# Altium schematic sheet SchematCzujnikUV.SchDoc
size A4; SheetNumber: 1; SheetTotal: 1; SPICEModelCacheTXBQMHXL: <root> / <DocumentId>TXBQMHXL</DocumentId> / <CacheFrame Number="0"> / <Model Name="cap" Kind="MDL"> / <Text>*Default semiconductor capacitor / .MODEL CAP C()</Text> / </Model> / </CacheFrame> / </root>
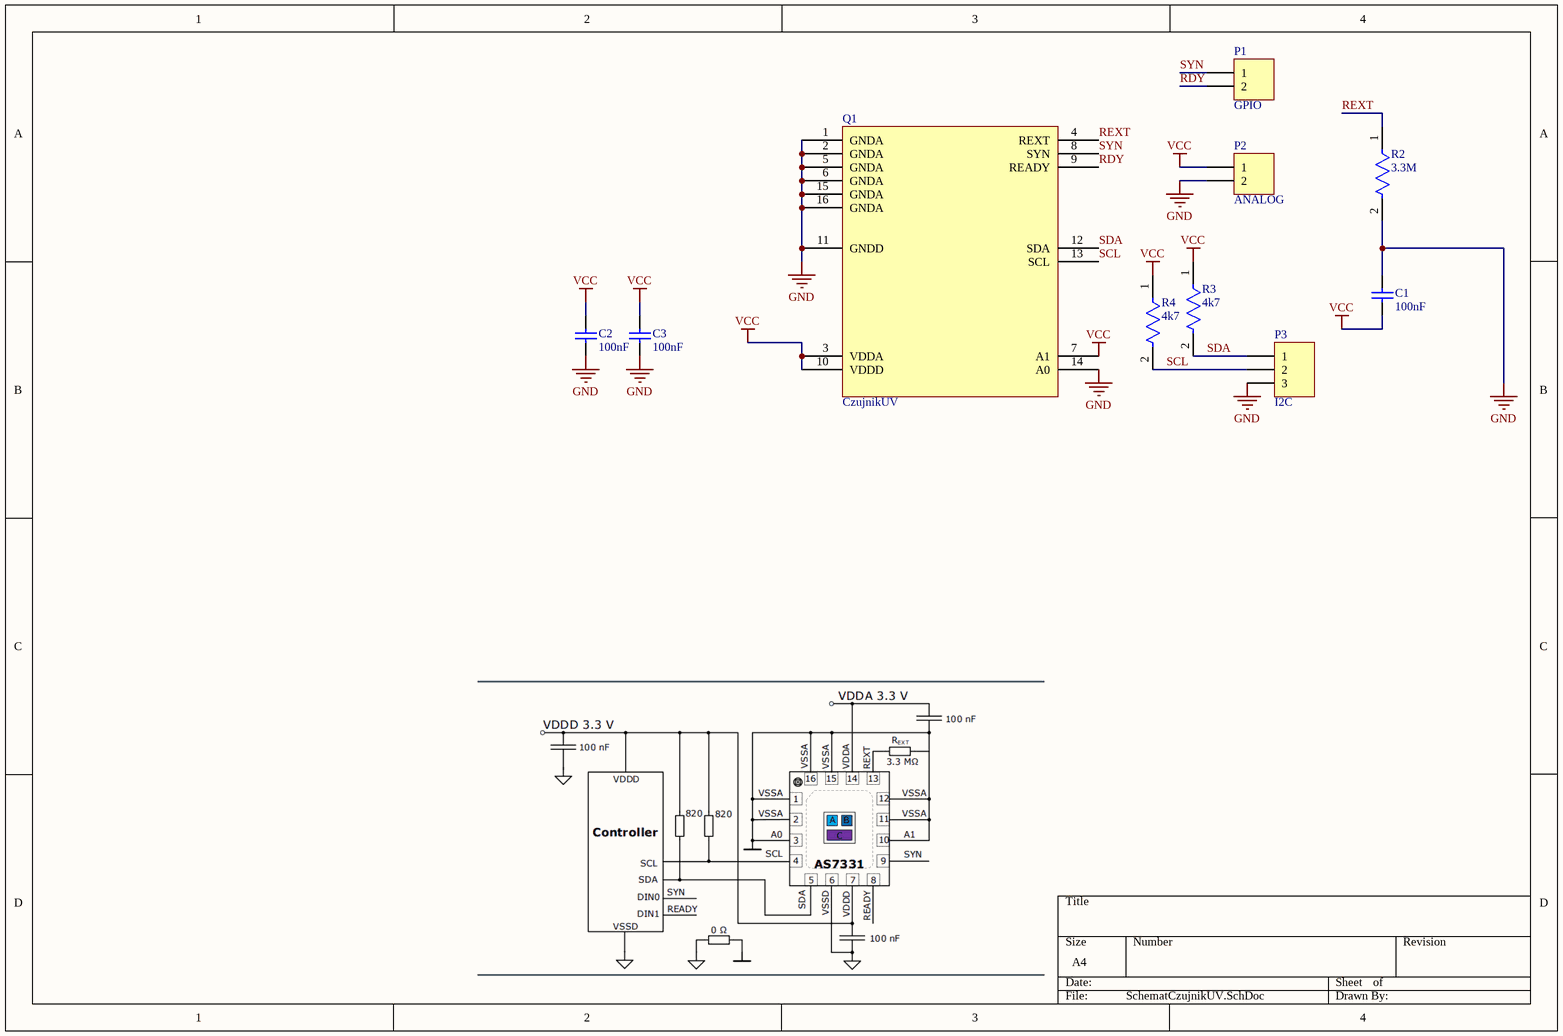
[diagram p0: SchematCzujnikUV.SchDoc]

## Parts
C1  100nF  [1608[0603]]
C2  100nF  [1608[0603]]
C3  100nF  [1608[0603]]
P1  GPIO  [HDR1X2]
P2  ANALOG  [HDR1X2]
P3  I2C  [HDR1X3]
Q1  CzujnikUV  [AS7331]
R2  3.3M  [FP-CRCW0603-e3-MFG]
R3  4k7  [FP-CRCW0603-e3-MFG]
R4  4k7  [FP-CRCW0603-e3-MFG]

## Nets
GND: C1.1 C2.2 C3.2 P2.2 P3.3 Q1.1(GNDA) Q1.2(GNDA) Q1.5(GNDA) Q1.6(GNDA) Q1.11(GNDD) Q1.14(A0) Q1.15(GNDA) Q1.16(GNDA) R2.2
VCC: C1.2 C2.1 C3.1 P2.1 Q1.3(VDDA) Q1.7(A1) Q1.10(VDDD) R3.1 R4.1
RDY: P1.2 Q1.9(READY)
REXT: Q1.4(REXT) R2.1
SCL: P3.2 Q1.13(SCL) R4.2
SDA: P3.1 Q1.12(SDA) R3.2
SYN: P1.1 Q1.8(SYN)

## Library data of the parts
C1-C3 = Cap Semi: Capacitor (Semiconductor SIM Model); Published: 8-Jun-2000; LatestRevisionDate: 29-May-2009; LatestRevisionNote: IPC-7351 Footprint Added.; PackageReference: C1206; Publisher: Altium Limited; PackageDescription: Chip Capacitor; Value: 100nF
P1 P2 = Header 2: Header, 2-Pin; LatestRevisionDate: 17-Jul-2002; LatestRevisionNote: Re-released for DXP Platform.; Publisher: Altium Limited
P3 = Header 3: Header, 3-Pin; LatestRevisionDate: 17-Jul-2002; LatestRevisionNote: Re-released for DXP Platform.; Publisher: Altium Limited
R2-R4 = CMP-2000-03525-2: RES Thick Film, 10kΩ, 1%, 0.1W, 100ppm/°C, 0603; Max Power Dissipation: 100mW; Working Voltage: 75V; Resistance: 66.5kR; Composition: Thick Film; Radiation Hardening: No; Length: 1.55mm; Package Quantity: 10; Min Operating Temperature: -55°C; Features: Automotive AEC-Q200; Number of Pins: 2; Weight: 7.1E-05oz; Case/Package: 0603; Case Code (Imperial): 0603; Military Standard: Not; Height: 0.45mm; Tolerance: 1%; Power Rating: 100mW; Voltage Rating: 75V; Case Code (Metric): 1608; Number of Terminations: 2; Width: 0.85mm; Packaging: Tape and Reel; Contact Plating: Tin; Termination: SMD/SMT; Max Operating Temperature: 155°C; Depth: 0.85mm; Temperature Coefficient: 100ppm/°C